# EasyEDA schematic SCH_555-Circuit_2025-10-18.json
TITLE: Sheet_1; REV: 1.0; Date: 2025-10-18; Sheet: 1/1; Drawn By: katherine.wilson.c08; Company: Your Company
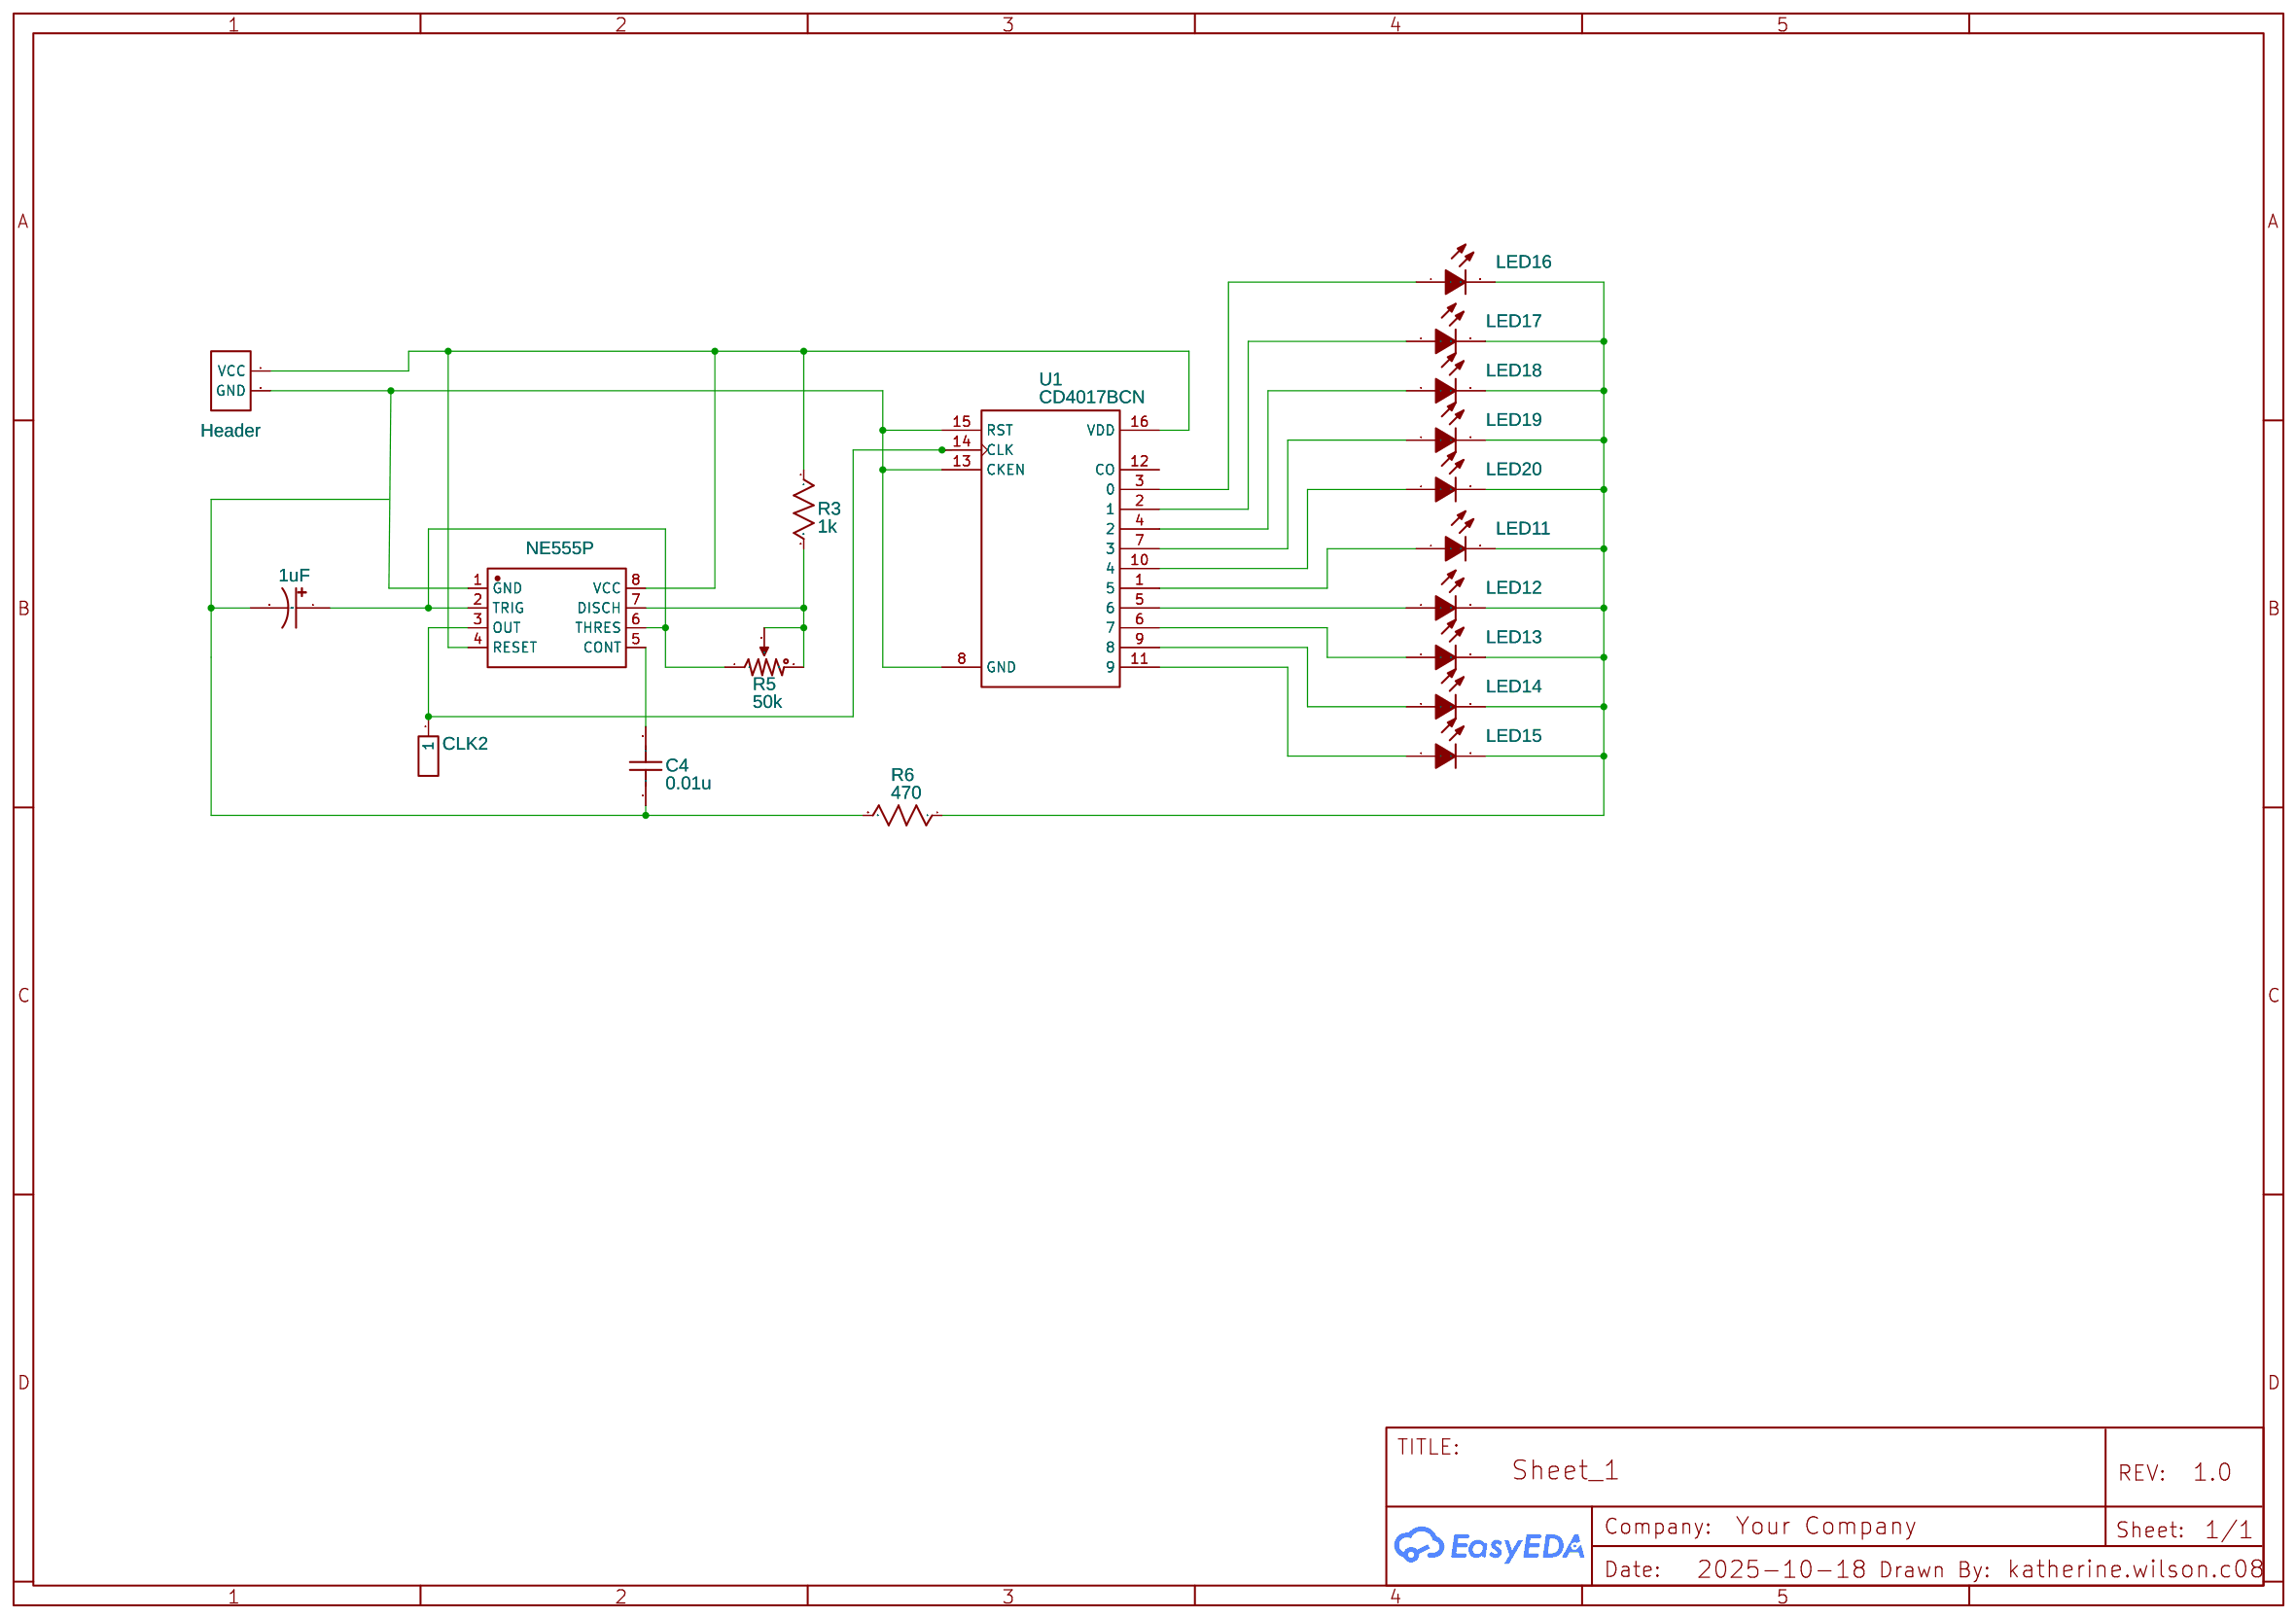
[diagram p0: schematic sheet]

## Parts
C3  1uF  [CAP-TH_BD5.0-P2.00-D0.8-FD]
C4  0.01u  [CAP-TH_L5.0-W2.1-P4.60-D0.4]
CLK2  C81276  [HDR-TH_1P-P2.54-V-M]
H2  Header  [HDR-M-2.54_1X2]
LED11  LED_5MM  [LED-TH_BD5.0-P2.54-FD_C9900023552]
LED12  LED_5MM  [LED-TH_BD5.0-P2.54-FD_C9900023552]
LED13  LED_5MM  [LED-TH_BD5.0-P2.54-FD_C9900023552]
LED14  LED_5MM  [LED-TH_BD5.0-P2.54-FD_C9900023552]
LED15  LED_5MM  [LED-TH_BD5.0-P2.54-FD_C9900023552]
LED16  LED_5MM  [LED-TH_BD5.0-P2.54-FD_C9900023552]
LED17  LED_5MM  [LED-TH_BD5.0-P2.54-FD_C9900023552]
LED18  LED_5MM  [LED-TH_BD5.0-P2.54-FD_C9900023552]
LED19  LED_5MM  [LED-TH_BD5.0-P2.54-FD_C9900023552]
LED20  LED_5MM  [LED-TH_BD5.0-P2.54-FD_C9900023552]
R3  1k  [R_AXIAL-0.3]
R5  50k  [RES-ADJ-3296X]
R6  470  [R_AXIAL-0.3]
U1  CD4017BCN  [DIP-16_L19.8-W6.5-P2.54-LS7.6-BL]
U3  NE555P  [DIP-8_L9.8-W6.6-P2.54-LS7.6-BL]

## Library data of the parts
C3 = UVZ1H010MDD: Contributor: LCSC; Supplier: LCSC; Supplier Part: C62934; Manufacturer: Nichicon(尼吉康)
C4 = C_0603_US: Supplier Part: C249157; Supplier: LCSC; Contributor: LCEDA_Lib; Package Display: No
CLK2 = Header-Male-2.54_1x1: Supplier: LCSC; Manufacturer Part: 2.54-1*1P针; JLCPCB Part Class: Extended Part; Package Display: No; Manufacturer: BOOMELE(Boom Precision Elec); Contributor: Thejo Prakash
H2 = HEADER-FEMALE-2.54_1X2: Contributor: nonstop2004; Supplier: LCSC; Supplier Part: C492401; Package Display: No
LED11-LED20 = LED_5MM: Contributor: lcsc; Supplier: LCSC; Supplier Part: C2895480
R3 = Resistor: Manufacturer Part: ?; Supplier Part: C713997; Supplier: LCSC
R5 = Potentiometer: K(%): 50; Manufacturer Part: ?; Supplier: LCSC; Supplier Part: C118912; Package Display: No
R6 = Resistor: Manufacturer Part: ?; Supplier Part: C58592; Supplier: LCSC
U1 = CD4017BCN: Decade CounterDivider with 10 Decoded Outputs; Supplier: LCSC; Supplier Part: C32710674; Package Display: No
U3 = NE555P: Supplier: LCSC; Manufacturer: TI(德州仪器); Supplier Part: C46749; JLCPCB Part Class: Extended Part

## Nets
Net-(C3-1): C3.1 R5.1 U3.2(TRIG) U3.6(THRES)
Net-(C3-2): C3.2 C4.1 R6.2
Net-(C4-2): C4.2 U3.5(CONT)
Net-(CLK2-1): CLK2.1 U1.14(CLK) U3.3(OUT)
Net-(H2-1): H2.1(VCC) R3.1 U1.16(VDD) U3.4(RESET) U3.8(VCC)
Net-(H2-2): H2.2(GND) U1.8(GND) U1.13(CKEN) U1.15(RST) U3.1(GND)
Net-(LED11-1): LED11.1(A) U1.1(5)
Net-(LED11-2): LED11.2(K) LED12.2(K) LED13.2(K) LED14.2(K) LED15.2(K) LED16.2(K) LED17.2(K) LED18.2(K) LED19.2(K) LED20.2(K) R6.1
Net-(LED12-1): LED12.1(A) U1.5(6)
Net-(LED13-1): LED13.1(A) U1.6(7)
Net-(LED14-1): LED14.1(A) U1.9(8)
Net-(LED15-1): LED15.1(A) U1.11(9)
Net-(LED16-1): LED16.1(A) U1.3(0)
Net-(LED17-1): LED17.1(A) U1.2(1)
Net-(LED18-1): LED18.1(A) U1.4(2)
Net-(LED19-1): LED19.1(A) U1.7(3)
Net-(LED20-1): LED20.1(A) U1.10(4)
Net-(R3-2): R3.2 R5.2(3) R5.3(2) U3.7(DISCH)

Not connected (* = marked no-connect by the designer): U1 12(CO)
